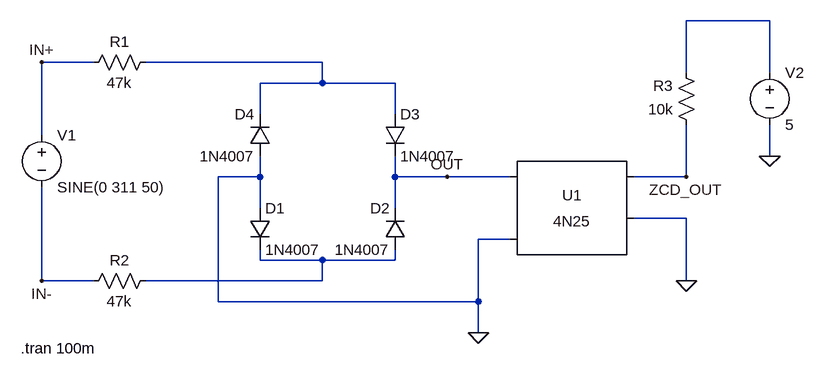
[diagram p0: schematic zero_crossing_detection.asc]
zero_crossing_detection.asc, the LTspice schematic file:
Version 4.1
SHEET 1 1336 1000
WIRE 544 480 416 480
WIRE -496 544 -576 544
WIRE -144 544 -416 544
WIRE 416 560 416 480
WIRE 544 560 544 480
WIRE -144 576 -144 544
WIRE -144 576 -240 576
WIRE -32 576 -144 576
WIRE -240 624 -240 576
WIRE -32 624 -32 576
WIRE -576 656 -576 544
WIRE 544 688 544 640
WIRE -240 720 -240 688
WIRE -240 720 -304 720
WIRE -32 720 -32 688
WIRE 48 720 -32 720
WIRE 144 720 48 720
WIRE 416 720 416 640
WIRE 416 720 336 720
WIRE -240 768 -240 720
WIRE -32 768 -32 720
WIRE 416 784 336 784
WIRE 144 816 96 816
WIRE -240 848 -240 832
WIRE -144 848 -240 848
WIRE -32 848 -32 832
WIRE -32 848 -144 848
WIRE -576 880 -576 736
WIRE -496 880 -576 880
WIRE -144 880 -144 848
WIRE -144 880 -416 880
WIRE 416 880 416 784
WIRE -304 912 -304 720
WIRE 96 912 96 816
WIRE 96 912 -304 912
WIRE 96 960 96 912
FLAG 544 688 0
FLAG 416 880 0
FLAG 48 720 OUT
FLAG 96 960 0
FLAG -576 880 IN-
FLAG -576 544 IN+
FLAG 416 720 ZCD_OUT
SYMBOL voltage -576 640 R0
WINDOW 123 0 0 Left 0
WINDOW 39 0 0 Left 0
SYMATTR InstName V1
SYMATTR Value SINE(0 311 50)
SYMBOL res -400 528 R90
WINDOW 0 0 56 VBottom 2
WINDOW 3 32 56 VTop 2
SYMATTR InstName R1
SYMATTR Value 47k
SYMBOL res -400 864 R90
WINDOW 0 0 56 VBottom 2
WINDOW 3 32 56 VTop 2
SYMATTR InstName R2
SYMATTR Value 47k
SYMBOL diode -256 768 R0
SYMATTR InstName D1
SYMATTR Value 1N4007
SYMBOL diode -16 832 R180
WINDOW 0 24 64 Left 2
WINDOW 3 24 0 Left 2
SYMATTR InstName D2
SYMATTR Value 1N4007
SYMBOL diode -48 624 R0
SYMATTR InstName D3
SYMATTR Value 1N4007
SYMBOL diode -224 688 R180
WINDOW 0 24 64 Left 2
WINDOW 3 24 0 Left 2
SYMATTR InstName D4
SYMATTR Value 1N4007
SYMBOL Optos\\4N25 240 784 R0
SYMATTR InstName U1
SYMBOL res 432 656 R180
WINDOW 0 36 76 Left 2
WINDOW 3 36 40 Left 2
SYMATTR InstName R3
SYMATTR Value 10k
SYMBOL voltage 544 544 R0
WINDOW 123 0 0 Left 0
WINDOW 39 0 0 Left 0
SYMATTR InstName V2
SYMATTR Value 5
TEXT -608 984 Left 2 !.tran 100m

The netlist it stands for:
* zero_crossing_detection.asc
V1 IN+ IN- SINE(0 311 50)
R1 N002 IN+ 47k
R2 N003 IN- 47k
D1 0 N003 1N4007
D2 N003 OUT 1N4007
D3 N002 OUT 1N4007
D4 0 N002 1N4007
X§U1 OUT 0 ZCD_OUT 0 NC_01 4N25
R3 ZCD_OUT N001 10k
V2 N001 0 5
.model D D
.lib standard.dio
.tran 100m
.lib 4N25.sub
.backanno
.end

* Results of the author's LTspice run, read from the files saved beside the schematic
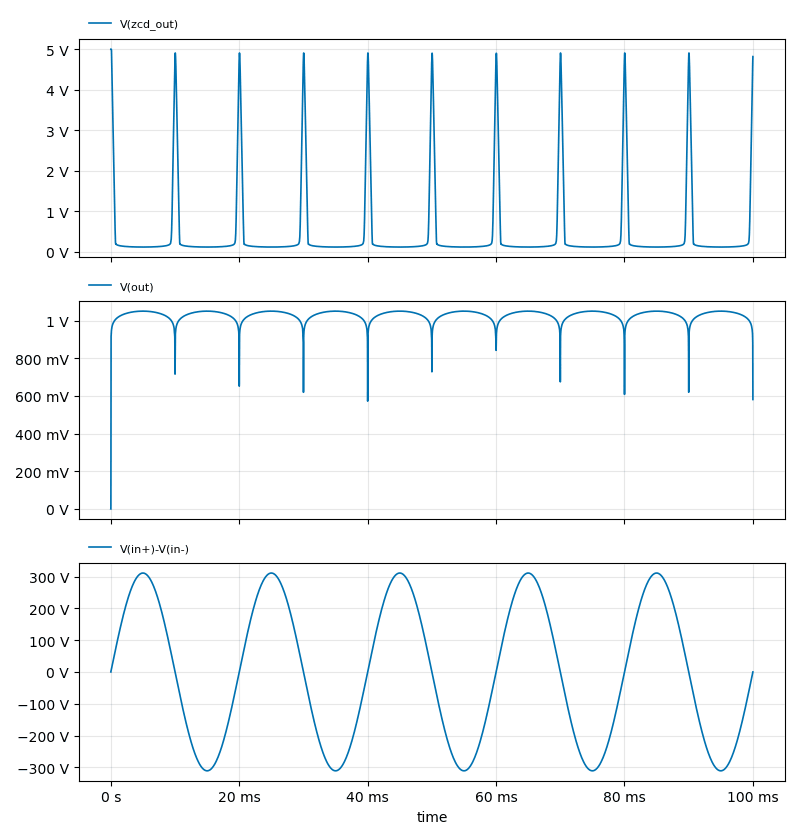
[diagram p1: Transient Analysis of zero_crossing_detection.asc, plotted from the saved traces]
* Transient Analysis, 1 run:
*   V(zcd_out): min 122.1 mV, max 5 V, average 466.8 mV, rms 1.105 V, last 4.819 V
*   V(out): min 0 V, max 1.05 V, average 1.028 V, rms 1.029 V, last 580.6 mV
*   V(in+)-V(in-): min -311 V, max 311 V, average 0 V, rms 219.9 V, last 0 V